# EAGLE design PGTN023_mix8 (EAGLE 9.6.0)
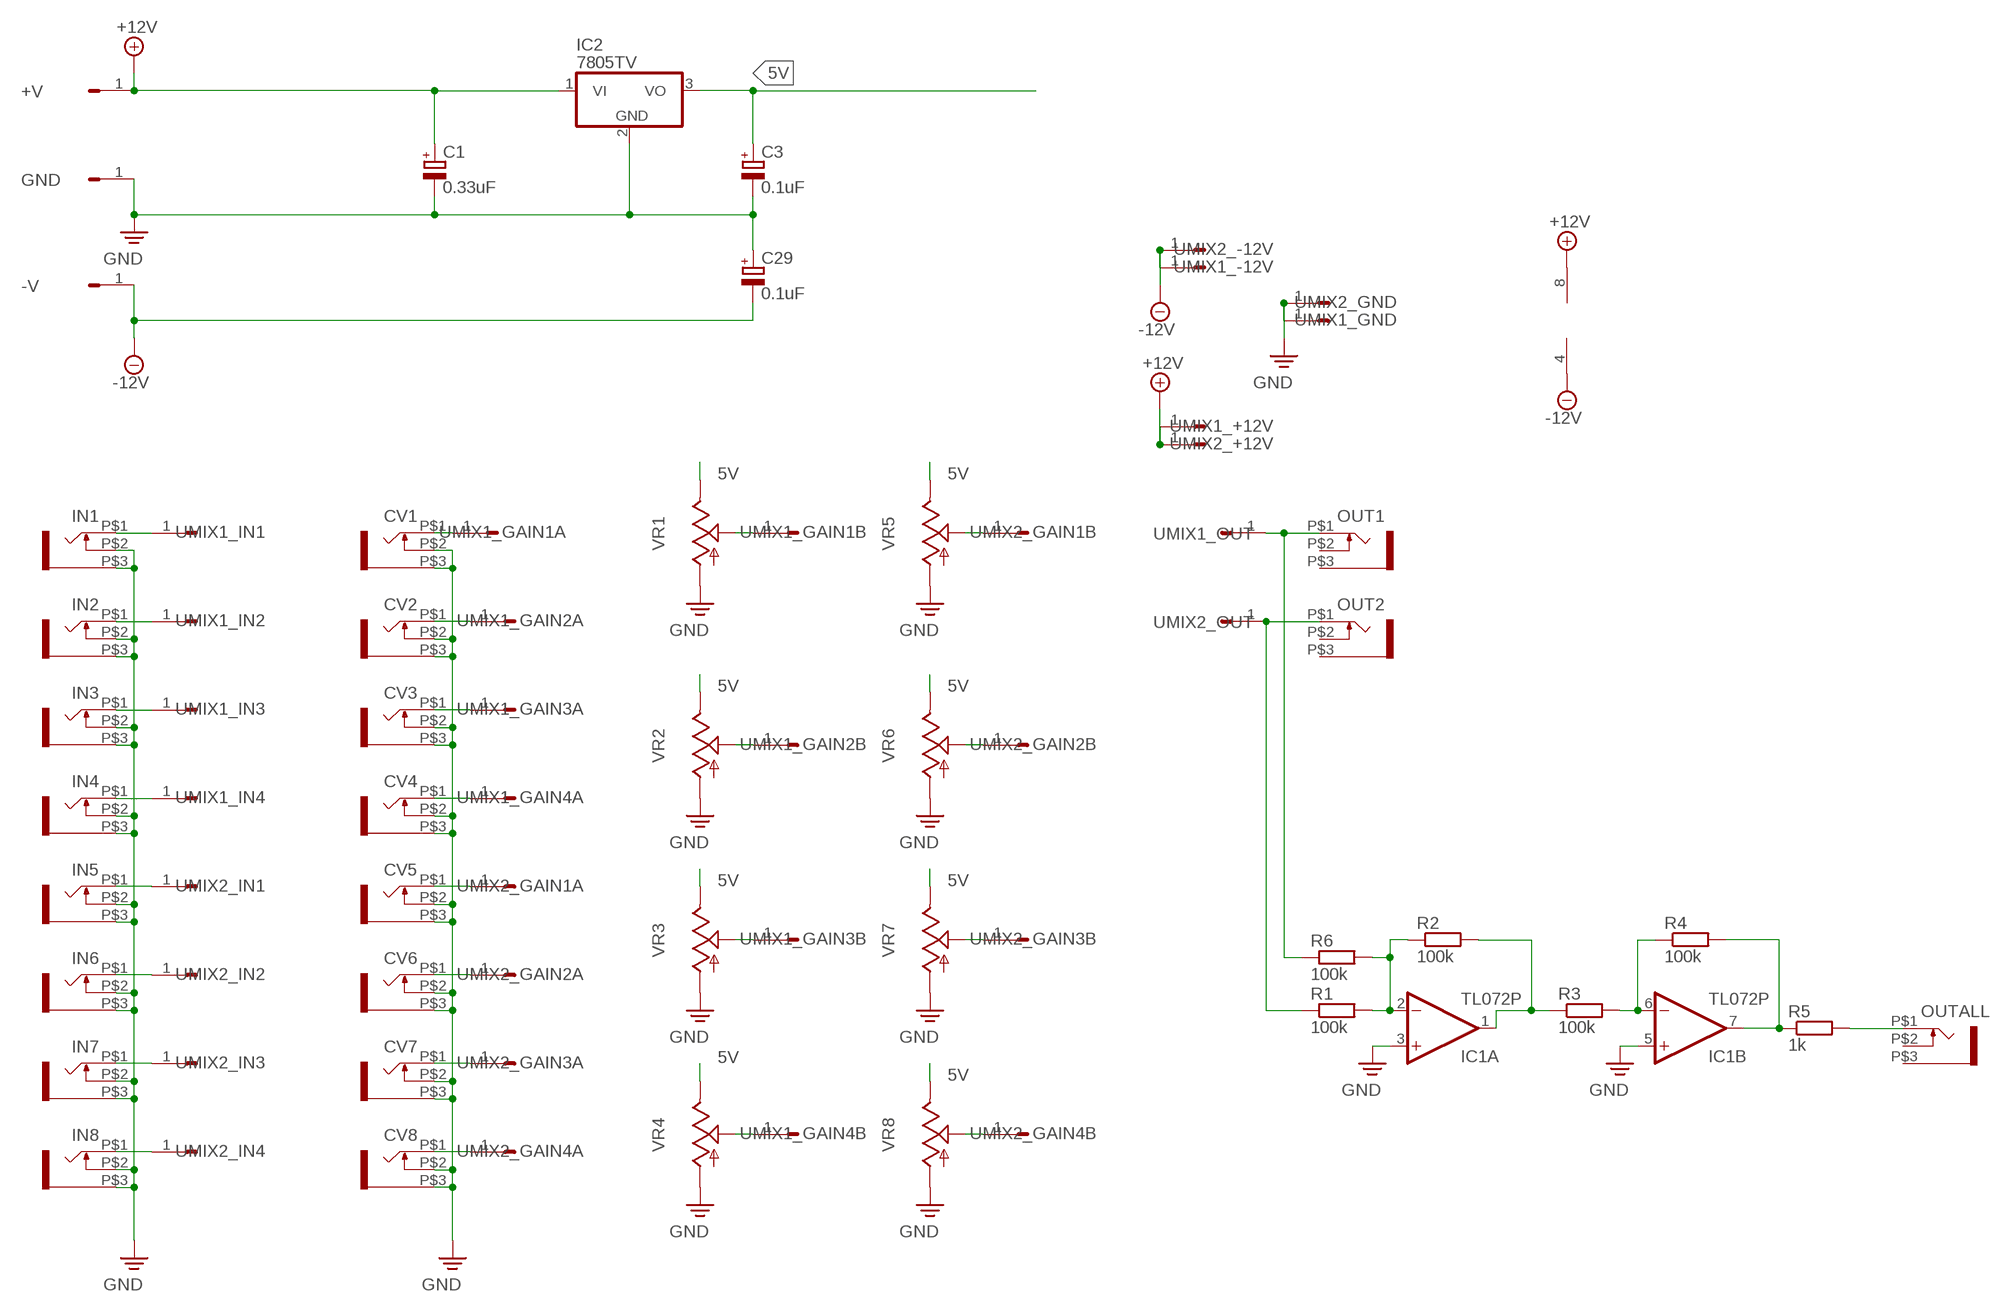
[diagram p0: schematic, sheet 1]

## Parts
+V  HEADER/MALE/01  [HEADER/MALE/01]
-V  HEADER/MALE/01  [HEADER/MALE/01]
C1  0.33uF  CAPACITOR/POLARIZEDE2.5-6  [E2,5-6]
C3  0.1uF  CAPACITOR/POLARIZEDE2.5-6  [E2,5-6]
C29  0.1uF  CAPACITOR/POLARIZEDE2.5-6  [E2,5-6]
CV1  WQP-PJ301M-12_JACK  [WQP-PJ301M-12_JACK]
CV2  WQP-PJ301M-12_JACK  [WQP-PJ301M-12_JACK]
CV3  WQP-PJ301M-12_JACK  [WQP-PJ301M-12_JACK]
CV4  WQP-PJ301M-12_JACK  [WQP-PJ301M-12_JACK]
CV5  WQP-PJ301M-12_JACK  [WQP-PJ301M-12_JACK]
CV6  WQP-PJ301M-12_JACK  [WQP-PJ301M-12_JACK]
CV7  WQP-PJ301M-12_JACK  [WQP-PJ301M-12_JACK]
CV8  WQP-PJ301M-12_JACK  [WQP-PJ301M-12_JACK]
GND  HEADER/MALE/01  [HEADER/MALE/01]
IC1  TL072P  [DIL08]
IC2  7805TV  [TO220V]
IN1  WQP-PJ301M-12_JACK  [WQP-PJ301M-12_JACK]
IN2  WQP-PJ301M-12_JACK  [WQP-PJ301M-12_JACK]
IN3  WQP-PJ301M-12_JACK  [WQP-PJ301M-12_JACK]
IN4  WQP-PJ301M-12_JACK  [WQP-PJ301M-12_JACK]
IN5  WQP-PJ301M-12_JACK  [WQP-PJ301M-12_JACK]
IN6  WQP-PJ301M-12_JACK  [WQP-PJ301M-12_JACK]
IN7  WQP-PJ301M-12_JACK  [WQP-PJ301M-12_JACK]
IN8  WQP-PJ301M-12_JACK  [WQP-PJ301M-12_JACK]
OUT1  WQP-PJ301M-12_JACK  [WQP-PJ301M-12_JACK]
OUT2  WQP-PJ301M-12_JACK  [WQP-PJ301M-12_JACK]
OUTALL  WQP-PJ301M-12_JACK  [WQP-PJ301M-12_JACK]
R1  100k  RESISTORRESISTOR/UPRIGHT/7.5  [RESISTOR/7.5]
R2  100k  RESISTORRESISTOR/UPRIGHT/7.5  [RESISTOR/7.5]
R3  100k  RESISTORRESISTOR/UPRIGHT/7.5  [RESISTOR/7.5]
R4  100k  RESISTORRESISTOR/UPRIGHT/7.5  [RESISTOR/7.5]
R5  1k  RESISTORRESISTOR/UPRIGHT/7.5  [RESISTOR/7.5]
R6  100k  RESISTORRESISTOR/UPRIGHT/7.5  [RESISTOR/7.5]
UMIX1_+12V  HEADER/MALE/01  [HEADER/MALE/01]
UMIX1_-12V  HEADER/MALE/01  [HEADER/MALE/01]
UMIX1_GAIN1A  HEADER/MALE/01  [HEADER/MALE/01]
UMIX1_GAIN1B  HEADER/MALE/01  [HEADER/MALE/01]
UMIX1_GAIN2A  HEADER/MALE/01  [HEADER/MALE/01]
UMIX1_GAIN2B  HEADER/MALE/01  [HEADER/MALE/01]
UMIX1_GAIN3A  HEADER/MALE/01  [HEADER/MALE/01]
UMIX1_GAIN3B  HEADER/MALE/01  [HEADER/MALE/01]
UMIX1_GAIN4A  HEADER/MALE/01  [HEADER/MALE/01]
UMIX1_GAIN4B  HEADER/MALE/01  [HEADER/MALE/01]
UMIX1_GND  HEADER/MALE/01  [HEADER/MALE/01]
UMIX1_IN1  HEADER/MALE/01  [HEADER/MALE/01]
UMIX1_IN2  HEADER/MALE/01  [HEADER/MALE/01]
UMIX1_IN3  HEADER/MALE/01  [HEADER/MALE/01]
UMIX1_IN4  HEADER/MALE/01  [HEADER/MALE/01]
UMIX1_OUT  HEADER/MALE/01  [HEADER/MALE/01]
UMIX2_+12V  HEADER/MALE/01  [HEADER/MALE/01]
UMIX2_-12V  HEADER/MALE/01  [HEADER/MALE/01]
UMIX2_GAIN1A  HEADER/MALE/01  [HEADER/MALE/01]
UMIX2_GAIN1B  HEADER/MALE/01  [HEADER/MALE/01]
UMIX2_GAIN2A  HEADER/MALE/01  [HEADER/MALE/01]
UMIX2_GAIN2B  HEADER/MALE/01  [HEADER/MALE/01]
UMIX2_GAIN3A  HEADER/MALE/01  [HEADER/MALE/01]
UMIX2_GAIN3B  HEADER/MALE/01  [HEADER/MALE/01]
UMIX2_GAIN4A  HEADER/MALE/01  [HEADER/MALE/01]
UMIX2_GAIN4B  HEADER/MALE/01  [HEADER/MALE/01]
UMIX2_GND  HEADER/MALE/01  [HEADER/MALE/01]
UMIX2_IN1  HEADER/MALE/01  [HEADER/MALE/01]
UMIX2_IN2  HEADER/MALE/01  [HEADER/MALE/01]
UMIX2_IN3  HEADER/MALE/01  [HEADER/MALE/01]
UMIX2_IN4  HEADER/MALE/01  [HEADER/MALE/01]
UMIX2_OUT  HEADER/MALE/01  [HEADER/MALE/01]
VR1  9MM_SNAP-IN_POT_  [9MM_SNAP-IN_POT]
VR2  9MM_SNAP-IN_POT_  [9MM_SNAP-IN_POT]
VR3  9MM_SNAP-IN_POT_  [9MM_SNAP-IN_POT]
VR4  9MM_SNAP-IN_POT_  [9MM_SNAP-IN_POT]
VR5  9MM_SNAP-IN_POT_  [9MM_SNAP-IN_POT]
VR6  9MM_SNAP-IN_POT_  [9MM_SNAP-IN_POT]
VR7  9MM_SNAP-IN_POT_  [9MM_SNAP-IN_POT]
VR8  9MM_SNAP-IN_POT_  [9MM_SNAP-IN_POT]

## Nets
5V: C3.+ IC2.3(VO) VR1.3(E) VR2.3(E) VR3.3(E) VR4.3(E) VR5.3(E) VR6.3(E) VR7.3(E) VR8.3(E)
+12V: +V.1 C1.+ IC1.8(P:V+) IC2.1(VI) UMIX1_+12V.1 UMIX2_+12V.1
-12V: -V.1 C29.- IC1.4(P:V-) UMIX1_-12V.1 UMIX2_-12V.1
N$1: IN1.P$1 UMIX1_IN1.1
N$2: IN2.P$1 UMIX1_IN2.1
N$3: IN3.P$1 UMIX1_IN3.1
N$4: IN4.P$1 UMIX1_IN4.1
N$5: IN5.P$1 UMIX2_IN1.1
N$6: IN6.P$1 UMIX2_IN2.1
N$7: IN7.P$1 UMIX2_IN3.1
N$8: IN8.P$1 UMIX2_IN4.1
N$9: CV1.P$1 UMIX1_GAIN1A.1
N$10: CV2.P$1 UMIX1_GAIN2A.1
N$11: CV3.P$1 UMIX1_GAIN3A.1
N$12: CV4.P$1 UMIX1_GAIN4A.1
N$13: CV5.P$1 UMIX2_GAIN1A.1
N$14: CV6.P$1 UMIX2_GAIN2A.1
N$15: CV7.P$1 UMIX2_GAIN3A.1
N$16: CV8.P$1 UMIX2_GAIN4A.1
N$17: OUT1.P$1 R6.1 UMIX1_OUT.1
N$18: OUT2.P$1 R1.1 UMIX2_OUT.1
N$19: UMIX1_GAIN1B.1 VR1.2(S)
N$20: UMIX1_GAIN2B.1 VR2.2(S)
N$21: UMIX1_GAIN3B.1 VR3.2(S)
N$22: UMIX1_GAIN4B.1 VR4.2(S)
N$23: UMIX2_GAIN1B.1 VR5.2(S)
N$24: UMIX2_GAIN2B.1 VR6.2(S)
N$25: UMIX2_GAIN3B.1 VR7.2(S)
N$26: UMIX2_GAIN4B.1 VR8.2(S)
N$27: IC1.2(A:-IN) R1.2 R2.1 R6.2
N$28: IC1.1(A:OUT) R2.2 R3.1
N$29: IC1.6(B:-IN) R3.2 R4.1
N$30: IC1.7(B:OUT) R4.2 R5.1
N$31: OUTALL.P$1 R5.2
PE: C1.- C3.- C29.+ CV1.P$2 CV1.P$3 CV2.P$2 CV2.P$3 CV3.P$2 CV3.P$3 CV4.P$2 CV4.P$3 CV5.P$2 CV5.P$3 CV6.P$2 CV6.P$3 CV7.P$2 CV7.P$3 CV8.P$2 CV8.P$3 GND.1 IC1.3(A:+IN) IC1.5(B:+IN) IC2.2(GND) IN1.P$2 IN1.P$3 IN2.P$2 IN2.P$3 IN3.P$2 IN3.P$3 IN4.P$2 IN4.P$3 IN5.P$2 IN5.P$3 IN6.P$2 IN6.P$3 IN7.P$2 IN7.P$3 IN8.P$2 IN8.P$3 UMIX1_GND.1 UMIX2_GND.1 VR1.1(A) VR2.1(A) VR3.1(A) VR4.1(A) VR5.1(A) VR6.1(A) VR7.1(A) VR8.1(A) ; supply symbol labelled GND
Unconnected: OUT1.P$2 OUT1.P$3 OUT2.P$2 OUT2.P$3 OUTALL.P$2 OUTALL.P$3

## Library data of the parts
+V -V GND UMIX1_+12V UMIX1_-12V UMIX1_GAIN1A UMIX1_GAIN1B UMIX1_GAIN2A UMIX1_GAIN2B UMIX1_GAIN3A UMIX1_GAIN3B UMIX1_GAIN4A UMIX1_GAIN4B UMIX1_GND UMIX1_IN1-UMIX1_IN4 UMIX1_OUT UMIX2_+12V UMIX2_-12V UMIX2_GAIN1A UMIX2_GAIN1B UMIX2_GAIN2A UMIX2_GAIN2B UMIX2_GAIN3A UMIX2_GAIN3B UMIX2_GAIN4A UMIX2_GAIN4B UMIX2_GND UMIX2_IN1-UMIX2_IN4 UMIX2_OUT = connectors:HEADER/MALE/01; SPICEPREFIX: X
C1 C3 C29 = capacitors:CAPACITOR/POLARIZED: POLARIZED CAPACITOR, European symbol; SPICEPREFIX: C
CV1-CV8 IN1-IN8 OUT1 OUT2 OUTALL = controls:WQP-PJ301M-12_JACK
IC1 = ic_analogue:TL072: OP AMP
IC2 = ic_voltage_reg:78*: Positive VOLTAGE REGULATOR Source: http://cache.national.com/ds/LM/LM78L05.pdf http://www.fairchildsemi.com/ds/LM/LM7805.pdf
R1-R6 = resistors:RESISTOR: RESISTOR, European symbol
VR1-VR8 = controls:9MM_SNAP-IN_POT: 9mm vertical snap-in pot, Alpha / Panasonic style

## Board
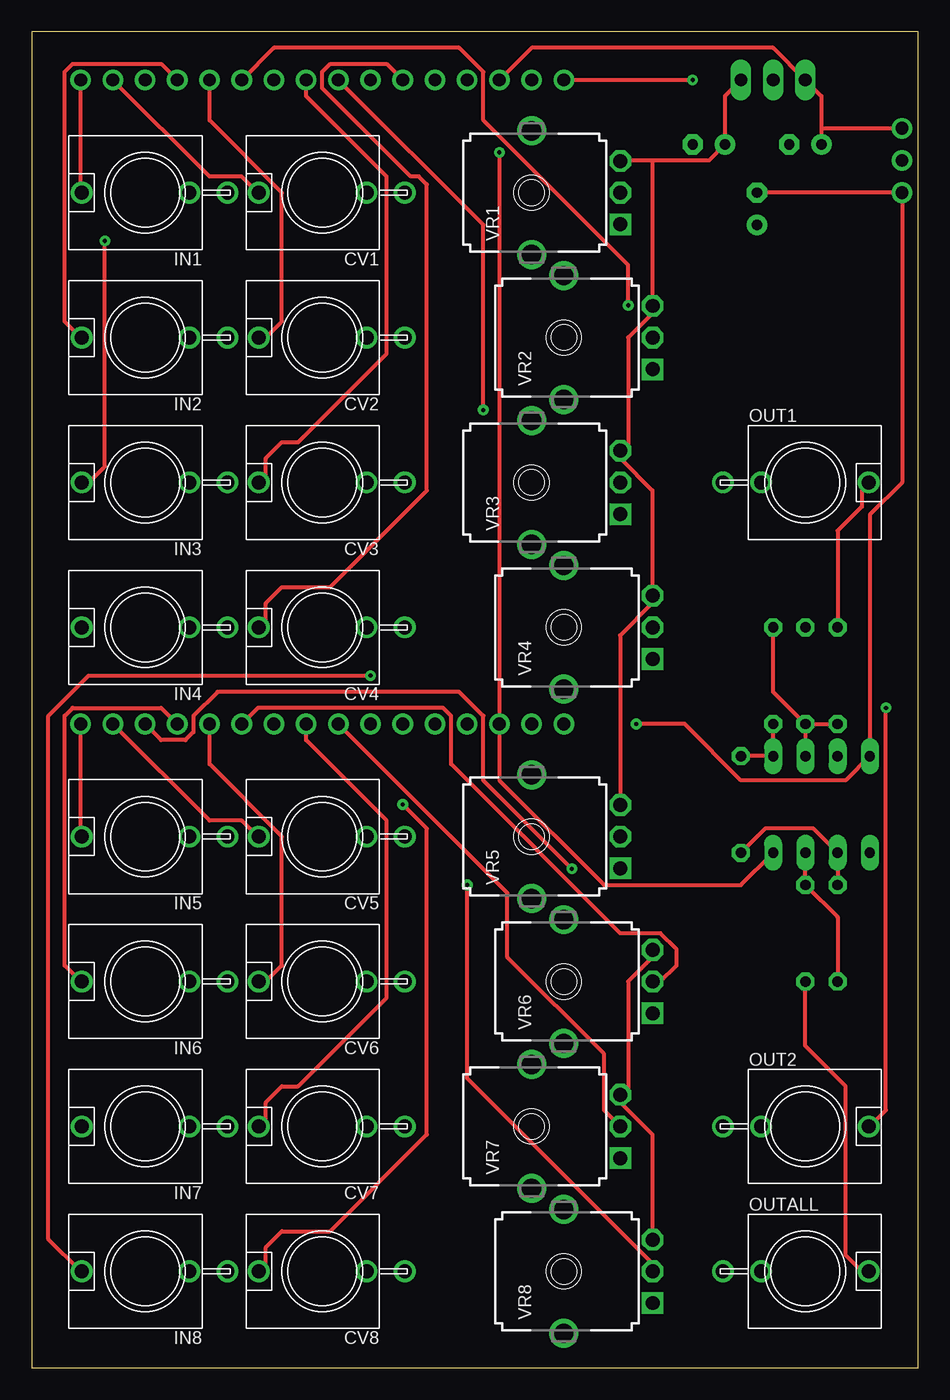
[diagram p1: board, top side]
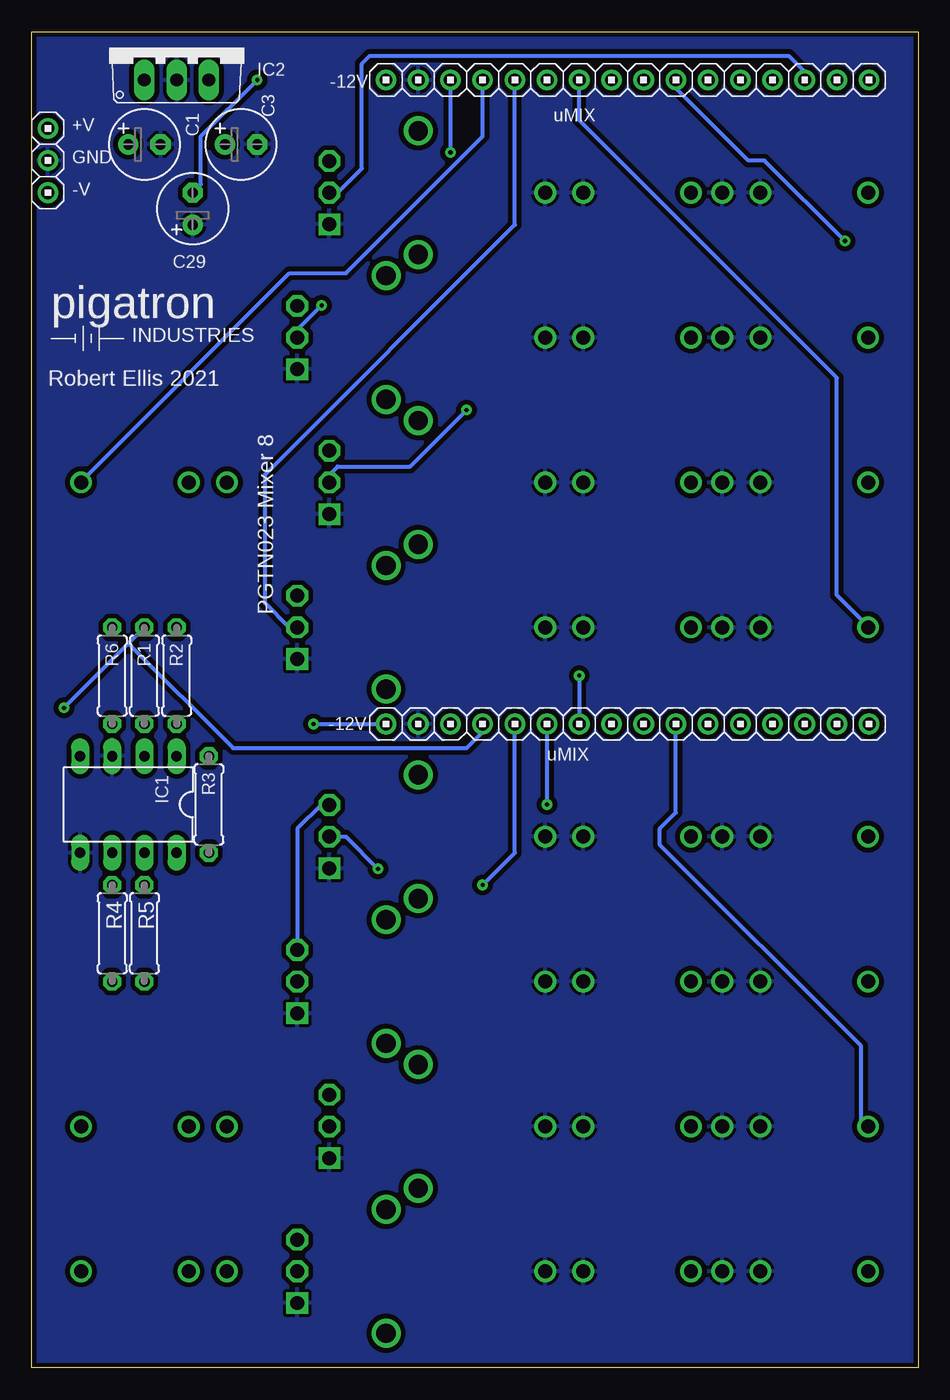
[diagram p2: board, bottom side, seen from below]

Size 69.9 x 105.4 mm. Coordinates in mm from the lower left corner, seen from the top.
Outline: 69.9,105.4 0,105.4 0,0 69.9,0 69.9,105.4
Copper layers (1*16): Top 0.0356mm / dielectric 1.5011mm / Bottom 0.0356mm
Design rules "pigatron": minimum track width 12mil, minimum drill 13mil, track to track 15mil, track to pad 10mil, pad to pad 10mil, via to via 10mil, smd to smd 6mil, copper to edge 15mil, drill to drill 10mil, minimum pad ring 12mil, minimum via ring 10mil, stop-mask expansion 4mil, vias tented up to drill 0mil, thermal gap 10mil

### Footprints (pad centres in the part's own frame; a part is rotated, then mirrored left to right if it is on the bottom)
HEADER/MALE/01 = drill 1.016: 1 0,0
E2,5-6 = drill 0.813 pad 1.6: + -1.27,0 | drill 0.813 pad 1.6 octagon: - 1.27,0
WQP-PJ301M-12_JACK = drill 1.1: P$1 0,5; P$2 0,-3.5; P$3 0,-6.5
DIL08 = drill 0.813 pad 1.27 long: 1 -3.81,-3.81; 2 -1.27,-3.81; 3 1.27,-3.81; 4 3.81,-3.81; 5 3.81,3.81; 6 1.27,3.81; 7 -1.27,3.81; 8 -3.81,3.81
TO220V = drill 1.016 long: 1 -2.54,-2.54; 2 0,-2.54; 3 2.54,-2.54
RESISTOR/7.5 = drill 0.813 octagon: 1 -3.81,0; 2 3.81,0
9MM_SNAP-IN_POT = drill 1.1 square: 1 -2.5,-7 | drill 1.1 octagon: 2 0,-7; 3 2.5,-7 | drill 1.524 pad 2.286: CHASSIS1 -4.881,0; CHASSIS2 4.881,0

### Placement (x,y rotation side)
+V  68.63,97.78 0 bottom
-V  68.63,92.7 0 bottom
C1  61.01,96.51 0 bottom
C3  53.39,96.51 0 bottom
C29  57.2,91.43 90 bottom
CV1  22.91,92.7 90 top
CV2  22.91,81.27 90 top
CV3  22.91,69.84 90 top
CV4  22.91,58.41 90 top
CV5  22.91,41.9 90 top
CV6  22.91,30.47 90 top
CV7  22.91,19.04 90 top
CV8  22.91,7.61 90 top
GND  68.63,95.24 0 bottom
IC1  62.28,44.44 180 bottom
IC2  58.47,104.13 0 bottom
IN1  8.94,92.7 90 top
IN2  8.94,81.27 90 top
IN3  8.94,69.84 90 top
IN4  8.94,58.41 90 top
IN5  8.94,41.9 90 top
IN6  8.94,30.47 90 top
IN7  8.94,19.04 90 top
IN8  8.94,7.61 90 top
OUT1  61.01,69.84 270 top
OUT2  61.01,19.04 270 top
OUTALL  61.01,7.61 270 top
R1  61.01,54.6 270 bottom
R2  58.47,54.6 270 bottom
R3  55.93,44.44 270 bottom
R4  63.55,34.28 270 bottom
R5  61.01,34.28 270 bottom
R6  63.55,54.6 270 bottom
U$5  [PIGATRON-LOGO]  59.49,82.79 0 bottom
UMIX1_+12V  36.88,101.59 270 bottom
UMIX1_-12V  41.96,101.59 180 bottom
UMIX1_GAIN1A  6.4,101.59 270 bottom
UMIX1_GAIN1B  8.94,101.59 270 bottom
UMIX1_GAIN2A  14.02,101.59 270 bottom
UMIX1_GAIN2B  16.56,101.59 270 bottom
UMIX1_GAIN3A  21.64,101.59 270 bottom
UMIX1_GAIN3B  24.18,101.59 270 bottom
UMIX1_GAIN4A  29.26,101.59 270 bottom
UMIX1_GAIN4B  31.8,101.59 270 bottom
UMIX1_GND  39.42,101.59 270 bottom
UMIX1_IN1  3.86,101.59 270 bottom
UMIX1_IN2  11.48,101.59 270 bottom
UMIX1_IN3  19.1,101.59 270 bottom
UMIX1_IN4  26.72,101.59 270 bottom
UMIX1_OUT  34.34,101.59 270 bottom
UMIX2_+12V  36.88,50.79 270 bottom
UMIX2_-12V  41.96,50.79 180 bottom
UMIX2_GAIN1A  6.4,50.79 270 bottom
UMIX2_GAIN1B  8.94,50.79 270 bottom
UMIX2_GAIN2A  14.02,50.79 270 bottom
UMIX2_GAIN2B  16.56,50.79 270 bottom
UMIX2_GAIN3A  21.64,50.79 270 bottom
UMIX2_GAIN3B  24.18,50.79 270 bottom
UMIX2_GAIN4A  29.26,50.79 270 bottom
UMIX2_GAIN4B  31.8,50.79 270 bottom
UMIX2_GND  39.42,50.79 270 bottom
UMIX2_IN1  3.86,50.79 270 bottom
UMIX2_IN2  11.48,50.79 270 bottom
UMIX2_IN3  19.1,50.79 270 bottom
UMIX2_IN4  26.72,50.79 270 bottom
UMIX2_OUT  34.34,50.79 270 bottom
VR1  39.42,92.7 90 top
VR2  41.96,81.27 90 top
VR3  39.42,69.84 90 top
VR4  41.96,58.41 90 top
VR5  39.42,41.9 90 top
VR6  41.96,30.47 90 top
VR7  39.42,19.04 90 top
VR8  41.96,7.61 90 top

### Tracks (layer width: path | path; a pad name or v marks a point on that pad's centre or on a via)
5V
  Top 0.305: VR6.3 48.95,32.38 47.04,30.47 47.04,21.58 VR7.3 46.41,20.94 48.95,18.4 48.95,10.15 VR8.3 | VR5.3 46.41,44.44 46.41,57.77 48.95,60.32 VR4.3 48.95,60.95 48.95,69.2 46.41,71.74 VR3.3 47.04,72.38 47.04,81.27 48.95,83.17 VR2.3 48.95,83.81 48.95,95.24 | IC2.3 54.66,100.32 C3.+ 53.39,95.24 48.95,95.24 | 48.95,95.24 47.04,95.24 VR1.3
  Bottom 0.305: VR6.3 48.95,33.01 48.95,42.54 47.04,44.44 VR5.3
+12V  (via drill 0.33)
  Top 0.305: IC1.8 55.93,38.09 45.14,38.09 36.88,46.34 UMIX2_+12V.1 v36.88,95.88 | 62.28,97.78 62.28,100.32 IC2.1 58.47,104.13 39.42,104.13 UMIX1_+12V.1 | 62.28,97.78 C1.+ | 62.28,97.78 +V.1
  Bottom 0.305: UMIX1_+12V.1 v36.88,95.88
-12V  (via drill 0.33)
  Top 0.305: C29.- -V.1 68.63,69.84 66.09,67.3 IC1.4 64.19,46.34 55.93,46.34 51.49,50.79 v47.68,50.79 | v52.12,101.59 UMIX1_-12V.1
  Bottom 0.305: v47.68,50.79 UMIX2_-12V.1 | v52.12,101.59 56.57,97.14 56.57,93.33 C29.-
N$1
  Top 0.305: UMIX1_IN1.1 3.86,92.7 IN1.P$1
N$2
  Top 0.305: UMIX1_IN2.1 10.21,102.86 3.23,102.86 2.59,102.22 2.59,82.54 3.86,81.27 IN2.P$1
N$3  (via drill 0.33)
  Top 0.305: v5.77,88.89 5.77,71.11 4.5,69.84 IN3.P$1
  Bottom 0.305: UMIX1_IN3.1 19.1,100.95 13.39,95.24 12.12,95.24 v5.77,88.89
N$4
  Bottom 0.305: UMIX1_IN4.1 26.72,98.41 6.4,78.09 6.4,60.95 3.86,58.41 IN4.P$1
N$5
  Top 0.305: UMIX2_IN1.1 3.86,41.9 IN5.P$1
N$6
  Top 0.305: UMIX2_IN2.1 10.21,52.06 3.23,52.06 2.59,51.43 2.59,31.74 3.86,30.47 IN6.P$1
N$7
  Bottom 0.305: UMIX2_IN3.1 19.1,43.8 20.37,42.54 20.37,41.27 4.5,25.39 4.5,19.04 IN7.P$1
N$8  (via drill 0.33)
  Top 0.305: v26.72,54.6 4.5,54.6 1.32,51.43 1.32,10.15 3.86,7.61 IN8.P$1
  Bottom 0.305: v26.72,54.6 UMIX2_IN4.1
N$9
  Top 0.305: UMIX1_GAIN1A.1 14.02,93.97 16.56,93.97 17.83,92.7 CV1.P$1
N$10
  Top 0.305: UMIX1_GAIN2A.1 14.02,98.41 19.74,92.7 19.74,82.54 18.47,81.27 CV2.P$1
N$11
  Top 0.305: UMIX1_GAIN3A.1 21.64,100.32 27.99,93.97 27.99,80 21.01,73.02 19.74,73.02 18.47,71.74 18.47,69.84 CV3.P$1
N$12
  Top 0.305: UMIX1_GAIN4A.1 27.99,102.86 23.55,102.86 22.91,102.22 22.91,100.95 29.9,93.97 30.53,93.97 31.17,93.33 31.17,69.2 23.55,61.59 19.74,61.59 18.47,60.32 18.47,58.41 CV4.P$1
N$13
  Top 0.305: UMIX2_GAIN1A.1 14.02,43.17 16.56,43.17 17.83,41.9 CV5.P$1
N$14
  Top 0.305: UMIX2_GAIN2A.1 14.02,47.62 19.74,41.9 19.74,31.74 18.47,30.47 CV6.P$1
N$15
  Top 0.305: UMIX2_GAIN3A.1 21.64,49.52 27.99,43.17 27.99,29.2 21.01,22.21 19.74,22.21 18.47,20.94 18.47,19.04 CV7.P$1
N$16  (via drill 0.33)
  Top 0.305: v29.26,44.44 31.17,42.54 31.17,18.4 23.55,10.79 19.74,10.79 18.47,9.52 18.47,7.61 CV8.P$1
  Bottom 0.305: v29.26,44.44 UMIX2_GAIN4A.1
N$17
  Top 0.305: R6.1 63.55,66.03 65.46,67.93 65.46,69.84 OUT1.P$1
  Bottom 0.305: UMIX1_OUT.1 34.34,97.14 45.14,86.35 49.58,86.35 66.09,69.84 OUT1.P$1
N$18  (via drill 0.33)
  Top 0.305: v67.36,52.06 67.36,20.31 66.09,19.04 OUT2.P$1
  Bottom 0.305: v67.36,52.06 62.28,57.14 | 62.28,57.14 R1.1 | UMIX2_OUT.1 34.34,50.16 35.61,48.89 54.03,48.89 62.28,57.14
N$19
  Bottom 0.305: UMIX1_GAIN1B.1 8.94,102.22 10.21,103.49 43.23,103.49 43.87,102.86 43.87,94.6 45.77,92.7 VR1.2
N$20  (via drill 0.33)
  Top 0.305: UMIX1_GAIN2B.1 19.1,104.13 33.71,104.13 35.61,102.22 35.61,98.41 47.04,86.98 v47.04,83.81
  Bottom 0.305: v47.04,83.81 49.58,81.27 VR2.2
N$21  (via drill 0.33)
  Top 0.305: UMIX1_GAIN3B.1 35.61,90.16 v35.61,75.55
  Bottom 0.305: v35.61,75.55 40.06,71.11 45.77,71.11 47.04,69.84 VR3.2
N$22
  Bottom 0.305: UMIX1_GAIN4B.1 31.8,90.16 51.49,70.47 51.49,60.32 49.58,58.41 VR4.2
N$23  (via drill 0.33)
  Top 0.305: UMIX2_GAIN1B.1 10.21,49.52 12.12,49.52 12.75,50.16 12.75,51.43 14.66,53.33 33.71,53.33 35.61,51.43 35.61,46.34 v42.6,39.36
  Bottom 0.305: v42.6,39.36 45.14,41.9 VR5.2
N$24
  Top 0.305: UMIX2_GAIN2B.1 17.83,52.06 32.44,52.06 33.07,51.43 33.07,47.62 46.41,34.28 49.58,34.28 50.85,33.01 50.85,31.74 49.58,30.47 VR6.2
N$25
  Top 0.305: UMIX2_GAIN3B.1 37.52,37.46 37.52,32.38 45.14,24.75 45.14,20.31 46.41,19.04 VR7.2
N$26  (via drill 0.33)
  Top 0.305: v34.34,38.09 34.34,22.85 49.58,7.61 VR8.2
  Bottom 0.305: UMIX2_GAIN4B.1 31.8,40.63 v34.34,38.09
N$27
  Top 0.305: R1.2 IC1.2 | R1.2 R6.2 | R2.1 58.47,53.33 R1.2
N$28
  Top 0.305: R3.1 IC1.1 R2.2
N$29
  Top 0.305: R3.2 57.84,42.54 61.65,42.54 IC1.6 R4.1
N$30
  Top 0.305: R4.2 63.55,35.55 R5.1 IC1.7
N$31
  Top 0.305: R5.2 61.01,25.39 64.19,22.21 64.19,8.88 65.46,7.61 OUTALL.P$1
PE
  pour Bottom: 69.9,-0.01 0.05,-0.01 0.05,105.4 69.9,105.4

### Text on the board
bNames: -12V | uMIX | Robert Ellis 2021 | PGTN023 Mixer 8 | -12V | uMIX